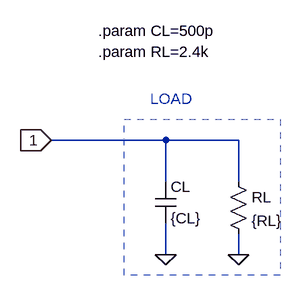
[diagram p0: schematic load1.asc]
load1.asc, the LTspice schematic file:
Version 4
SHEET 1 880 680
WIRE -128 224 -304 224
WIRE -128 224 -16 224
WIRE -128 288 -128 224
WIRE -16 288 -16 224
WIRE -128 352 -128 400
WIRE -16 368 -16 400
FLAG -128 400 0
FLAG -304 224 1
IOPIN -304 224 In
FLAG -16 400 0
SYMBOL cap -144 288 R0
SYMATTR InstName CL
SYMATTR Value {CL}
SYMBOL res -32 272 R0
SYMATTR InstName RL
SYMATTR Value {RL}
TEXT -232 56 Left 0 !.param CL=500p
TEXT -232 88 Left 0 !.param RL=2.4k
TEXT -152 160 Left 0 ;LOAD
RECTANGLE Normal 48 432 -192 192 2

The netlist it stands for:
* load1.asc
CL 1 0 {CL}
RL 1 0 {RL}
.param CL=500p
.param RL=2.4k
* LOAD
.backanno
.end